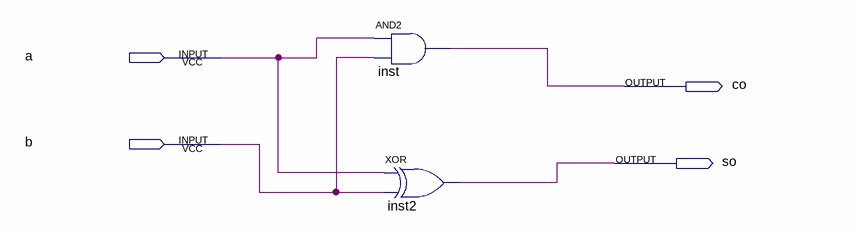
[diagram p0: schematic sheet]
// Quartus schematic add5.bdf as structural Verilog: 2 symbols, 4 pins
module add5 (
  input  a,
  input  b,
  output co,
  output so
);

  and inst (co, a, b);
  xor inst2 (so, a, b);
endmodule
